# EAGLE schematic schematic_v2 (EAGLE 9.6.2)
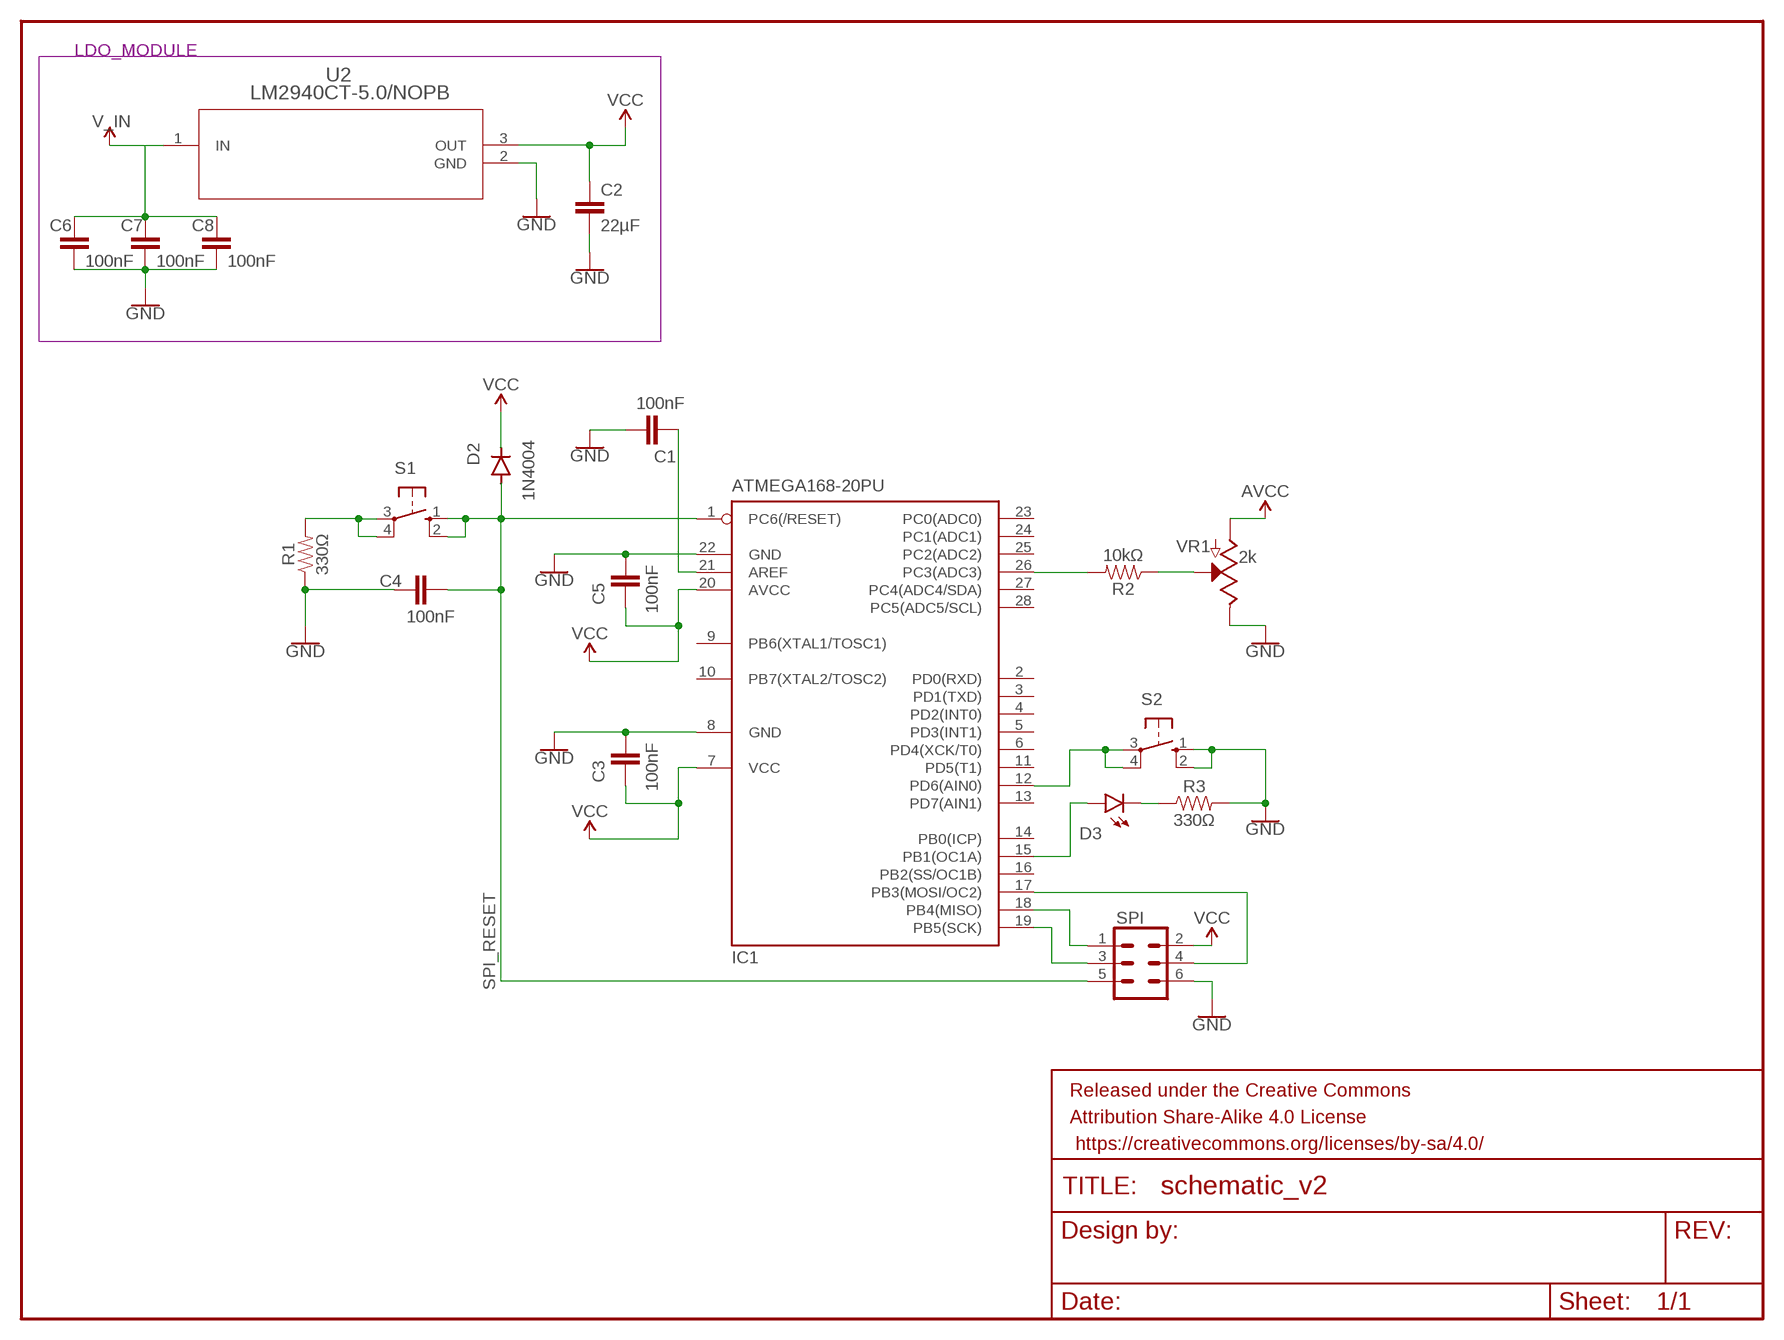
[diagram p0: schematic, sheet 1]

## Parts
C1  100nF  470PF-0603-50V-5%  [0603]
C2  22µF  22PF-PTH-2.54MM-200V-5%  [CAP-PTH-2.54]
C3  100nF  470PF-0603-50V-5%  [0603]
C4  100nF  470PF-0603-50V-5%  [0603]
C5  100nF  470PF-0603-50V-5%  [0603]
C6  100nF  470PF-0603-50V-5%  [0603]
C7  100nF  470PF-0603-50V-5%  [0603]
C8  100nF  470PF-0603-50V-5%  [0603]
D2  1N4004  [DO41-10]
D3  LED5MM  [LED_5MM]
FRAME1  FRAME-LETTER  [CREATIVE_COMMONS]
IC1  ATMEGA168-20PU  [DIL28-3]
R1  330Ω  10OHM-HORIZ-1/4W-1%  [AXIAL-0.3]
R2  10kΩ  10OHM-HORIZ-1/4W-1%  [AXIAL-0.3]
R3  330Ω  10OHM-HORIZ-1/4W-1%  [AXIAL-0.3]
S1  10-XX  [B3F-10XX]
S2  10-XX  [B3F-10XX]
SPI  CONN_03X22X3_SILK_MALE_PTH  [2X3]
U2  LM2940CT-5.0/NOPB  [T03B]
VR1  2k  POTENTIOMETER-PTH-9MM-1/20W-20%-KIT  [POT-PTH-ALPS-KIT]

## Nets
GND: C1.2 C2.2 C3.2 C4.1 C5.2 IC1.8(GND) IC1.22(GND) R1.P$1 R3.P$2 S2.1(S) S2.2(S1) SPI.6 U2.2(GND) VR1.P$1(E)
GND1: C6.2 C7.2 C8.2 ; supply symbol labelled GND
N$1: IC1.19(PB5(SCK)) SPI.3
N$2: R1.P$2 S1.3(P) S1.4(P1)
N$3: IC1.18(PB4(MISO)) SPI.1
N$4: D3.A IC1.15(PB1(OC1A))
N$5: IC1.26(PC3(ADC3)) R2.P$2
N$6: D3.K(C) R3.P$1
N$7: IC1.17(PB3(MOSI/OC2)) SPI.4
N$8: IC1.12(PD6(AIN0)) S2.3(P) S2.4(P1)
N$9: R2.P$1 VR1.P$2(S)
N$10: C1.1 IC1.21(AREF)
SPI_RESET: C4.2 D2.A IC1.1(PC6(/RESET)) S1.1(S) S1.2(S1) SPI.5
V_IN: U2.1(IN) ; supply symbol labelled VCC
V_IN1: C6.1 C7.1 C8.1
VCC: C2.1 C3.1 C5.1 D2.C IC1.7(VCC) IC1.20(AVCC) SPI.2 U2.3(OUT) VR1.P$3(A) ; supply symbol labelled AVCC
Unconnected: IC1.2(PD0(RXD)) IC1.3(PD1(TXD)) IC1.4(PD2(INT0)) IC1.5(PD3(INT1)) IC1.6(PD4(XCK/T0)) IC1.9(PB6(XTAL1/TOSC1)) IC1.10(PB7(XTAL2/TOSC2)) IC1.11(PD5(T1)) IC1.13(PD7(AIN1)) IC1.14(PB0(ICP)) IC1.16(PB2(SS/OC1B)) IC1.23(PC0(ADC0)) IC1.24(PC1(ADC1)) IC1.25(PC2(ADC2)) IC1.27(PC4(ADC4/SDA)) IC1.28(PC5(ADC5/SCL))

## Notes on the sheet
- LDO_MODULE

## Library data of the parts
C1 C3-C5 = SparkFun-Capacitors:470PF: 470pF ceramic capacitors A capacitor is a passive two-terminal electrical component used to store electrical energy temporarily in an electric field.; PROD_ID: CAP-07884; VALUE: 470pF
C2 = SparkFun-Capacitors:22PF: 22pF ceramic capacitors A capacitor is a passive two-terminal electrical component used to store electrical energy temporarily in an electric field.; PROD_ID: CAP-09128; SPICEPREFIX: C; VALUE: 22pF
C6-C8 = SparkFun-Capacitors:470PF: 470pF ceramic capacitors A capacitor is a passive two-terminal electrical component used to store electrical energy temporarily in an electric field.; PROD_ID: CAP-07884; SPICEPREFIX: C; VALUE: 470pF
D2 = diode:1N4004: DIODE general purpose rectifier, 1 A
D3 = SparkFun-LED:LED: LED (Generic) Standard schematic elements and footprints for 5mm, 3mm, 1206, and 0603 sized LEDs. Generic LEDs with no color specified.
FRAME1 = SparkFun-Aesthetics:FRAME-LETTER: Schematic Frame - Letter Standard 8.5x11 US Letter frame
IC1 = atmega_and_voltage_reg:ATMEGA168-20PU: ICC002
R1-R3 = SparkFun-Resistors:10OHM: 10Ω resistor A resistor is a passive two-terminal electrical component that implements electrical resistance as a circuit element. Resistors act to reduce current flow, and, at the same time, act to lower voltage levels within circuits. - Wikipedia; PROD_ID: RES-12180; VALUE: 10
S1 S2 = switch-omron:10-XX: OMRON SWITCH; MPN: B3F-1000; OC_FARNELL: 176432; OC_NEWARK: 36M3542
SPI = SparkFun-Connectors:CONN_03X2: Multi connection point. Often used as Generic Header-pin footprint for 0.1 inch spaced/style header connections You can populate with any combo of single row headers, but if you'd like an exact match, check these: Header - 2x3 (Male, 0.1") <https://www.sparkfun.com/products/12807> (PRT-12807) Header - 2x3 (Female, 0.1") <https://www.sparkfun.com/products/13010> (PRT-13010) 2x3 Pin Shrouded Header <https://www.sparkfun.com/products/10877> (PRT-10877) On any of the 0.1 inch spaced packages, you can populate with these: Break Away Headers - Straight <https://www.sparkfun.com/products/116> (PRT-00116) Break Away Male Headers - Right Angle <https://www.sparkfun.com/products/553> (PRT-00553) Female Headers <https://www.sparkfun.com/products/115> (PRT-00115) Break Away Headers - Machine Pin <https://www.sparkfun.com/products/117> (PRT-00117) Break Away Female Headers - Swiss Machine Pin <https://www.sparkfun.com/products/743> (PRT-00743) Special note: the shrouded connector mates well with our 3x2 ribbon cables: Ribbon Crimp Connector - 6-pin (2x3, Female) <https://www.sparkfun.com/products/10651> (PRT-10651) Ribbon Cable - 6 wire (15ft) <https://www.sparkfun.com/products/10646> (PRT-10646); PROD_ID: CONN-09701
U2 = Voltage_regulator_footprints:LM2940CT-5.0/NOPB; COPYRIGHT: Copyright (C) 2023 Ultra Librarian. All rights reserved.; MANUFACTURER_PART_NUMBER: LM2940CT-5.0/NOPB; MFR_NAME: Texas Instruments; SPICEPREFIX: U; TYPE: LM2940CT-12
VR1 = SparkFun-Resistors:POTENTIOMETER: Potentiometer (Pot) Three-terminal potentiometers, with an adjustable wiper and two adjustable resistors. A pot can be used to create a configurable voltage divider, or as a variable resistor. Variants ALPS_POT and ALPS_POT_KIT - PTH, breadboard compatible, 9mm square pots Rotary Potentiometer - Linear (10k ohm) <https://www.sparkfun.com/products/9288> (COM-09288) The KIT variant exposes copper on only one side of the PTH pad, so the part can only be assembled on one side of the PCB. Useful for beginner soldering kits.; PROD_ID: RES-09177; SF_SKU: COM-09288; VALUE: 10k

## Module TEST
Ports: V_OUT(io)

### Library data of the parts